# Altium schematic sheet MCU_B.SchDoc
size A3; SheetNumber: 2; SheetTotal: 5
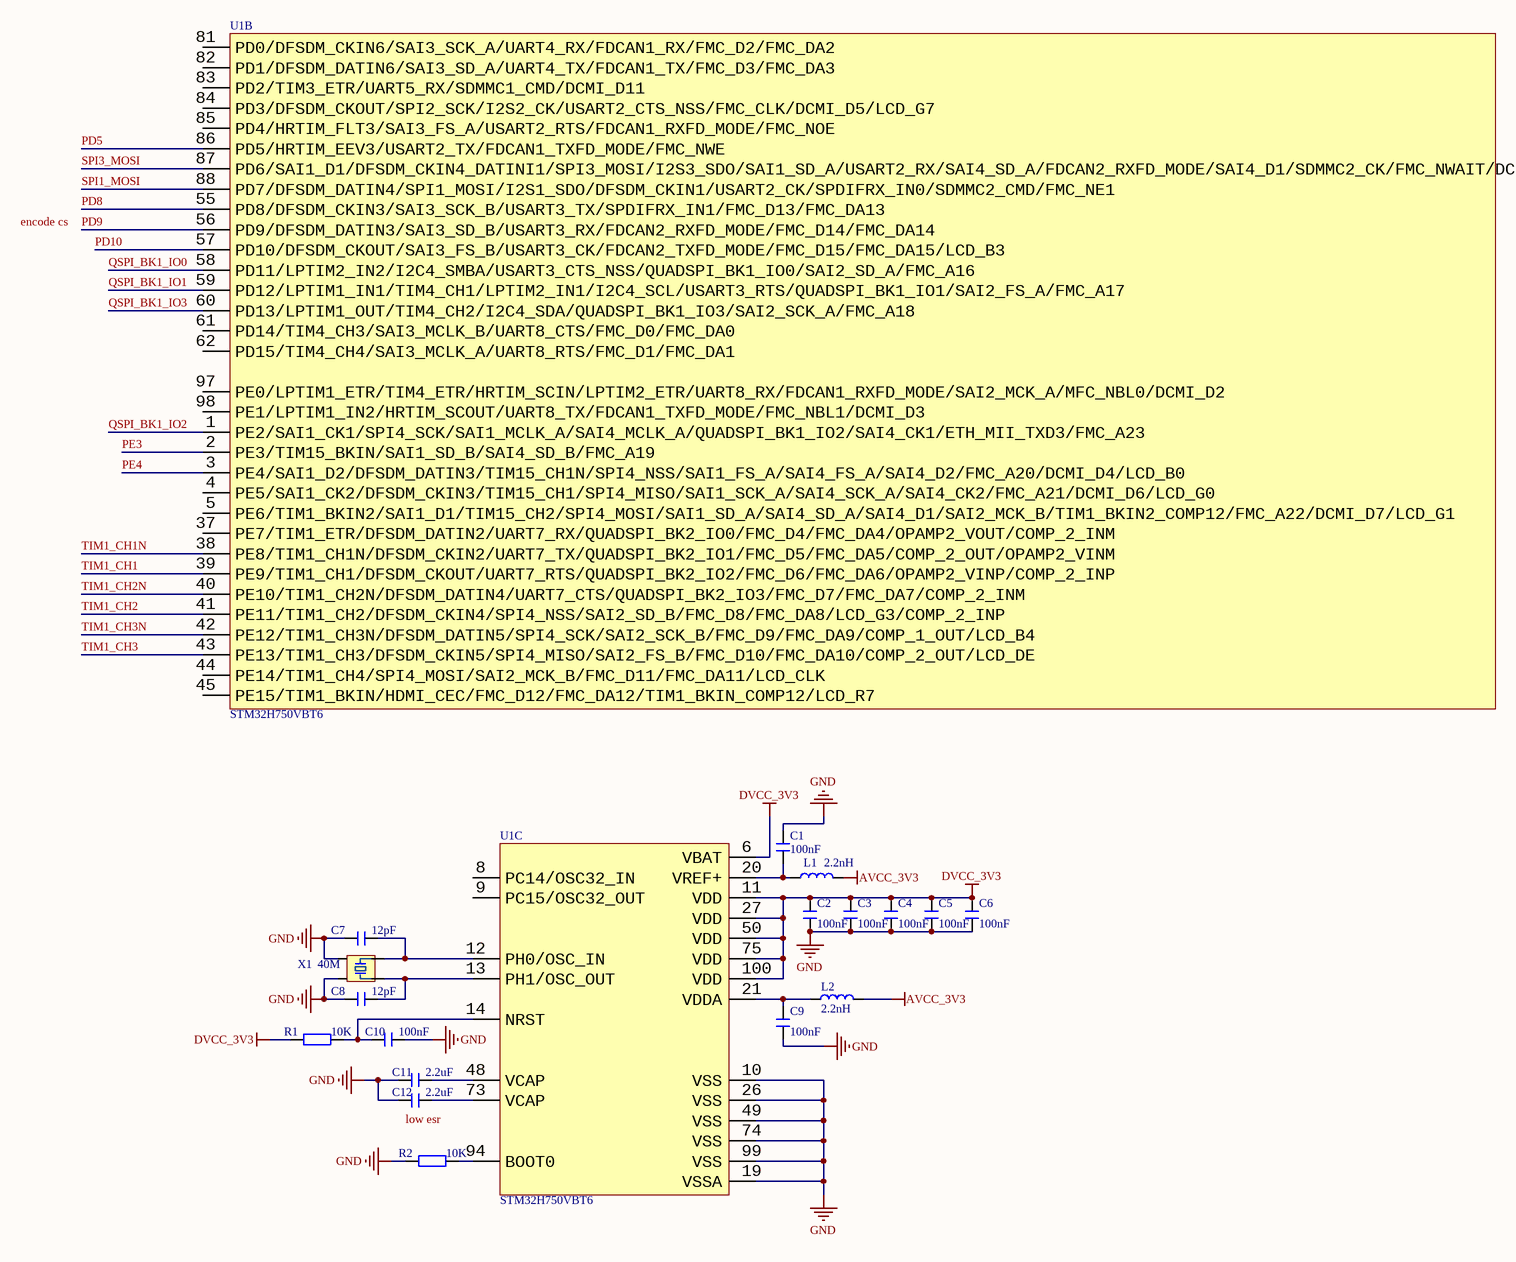
[diagram p0: MCU_B.SchDoc]

## Parts
C1  100nF  [C 0402_L]
C2  100nF  [C 0402_L]
C3  100nF  [C 0402_L]
C4  100nF  [C 0402_L]
C5  100nF  [C 0402_L]
C6  100nF  [C 0402_L]
C7  12pF  [C 0402_L]
C8  12pF  [C 0402_L]
C9  100nF  [C 0402_L]
C10  100nF  [C 0402_L]
C11  2.2uF  [C 0402_L]
C12  2.2uF  [C 0402_L]
L1  2.2nH  [L 0402]
L2  2.2nH  [L 0402]
R1  10K  [R 0402_L]
R2  10K  [R 0402_L]
U1  STM32H750VBT6  [LQFP100 14x14_L]  (parts B,C of 3)
X1  40M  [OSC 2016-4P]

## Nets
AVCC_3V3: L1.2 L2.2
DVCC_3V3: C2.2 C3.2 C4.2 C5.2 C6.2 R1.1 U1.6(VBAT) U1.11(VDD) U1.27(VDD) U1.50(VDD) U1.75(VDD) U1.100(VDD)
GND: C1.2 C2.1 C3.1 C4.1 C5.1 C6.1 C7.1 C8.1 C9.1 C10.2 C11.1 C12.1 R2.1 U1.10(VSS) U1.19(VSSA) U1.26(VSS) U1.49(VSS) U1.74(VSS) U1.99(VSS) X1.2 X1.4
PD5: U1.86(PD5/HRTIM_EEV3/USART2_TX/FDCAN1_TXFD_MODE/FMC_NWE)
PD8: U1.55(PD8/DFSDM_CKIN3/SAI3_SCK_B/USART3_TX/SPDIFRX_IN1/FMC_D13/FMC_DA13)
PD9: U1.56(PD9/DFSDM_DATIN3/SAI3_SD_B/USART3_RX/FDCAN2_RXFD_MODE/FMC_D14/FMC_DA14)
PD10: U1.57(PD10/DFSDM_CKOUT/SAI3_FS_B/USART3_CK/FDCAN2_TXFD_MODE/FMC_D15/FMC_DA15/LCD_B3)
PE3: U1.2(PE3/TIM15_BKIN/SAI1_SD_B/SAI4_SD_B/FMC_A19)
PE4: U1.3(PE4/SAI1_D2/DFSDM_DATIN3/TIM15_CH1N/SPI4_NSS/SAI1_FS_A/SAI4_FS_A/SAI4_D2/FMC_A20/DCMI_D4/LCD_B0)
QSPI_BK1_IO0: U1.58(PD11/LPTIM2_IN2/I2C4_SMBA/USART3_CTS_NSS/QUADSPI_BK1_IO0/SAI2_SD_A/FMC_A16)
QSPI_BK1_IO1: U1.59(PD12/LPTIM1_IN1/TIM4_CH1/LPTIM2_IN1/I2C4_SCL/USART3_RTS/QUADSPI_BK1_IO1/SAI2_FS_A/FMC_A17)
QSPI_BK1_IO2: U1.1(PE2/SAI1_CK1/SPI4_SCK/SAI1_MCLK_A/SAI4_MCLK_A/QUADSPI_BK1_IO2/SAI4_CK1/ETH_MII_TXD3/FMC_A23)
QSPI_BK1_IO3: U1.60(PD13/LPTIM1_OUT/TIM4_CH2/I2C4_SDA/QUADSPI_BK1_IO3/SAI2_SCK_A/FMC_A18)
SPI1_MOSI: U1.88(PD7/DFSDM_DATIN4/SPI1_MOSI/I2S1_SDO/DFSDM_CKIN1/USART2_CK/SPDIFRX_IN0/SDMMC2_CMD/FMC_NE1)
SPI3_MOSI: U1.87(PD6/SAI1_D1/DFSDM_CKIN4_DATINI1/SPI3_MOSI/I2S3_SDO/SAI1_SD_A/USART2_RX/SAI4_SD_A/FDCAN2_RXFD_MODE/SAI4_D1/SDMMC2_CK/FMC_NWAIT/DCMI_D10/LCD_B2)
TIM1_CH1: U1.39(PE9/TIM1_CH1/DFSDM_CKOUT/UART7_RTS/QUADSPI_BK2_IO2/FMC_D6/FMC_DA6/OPAMP2_VINP/COMP_2_INP)
TIM1_CH1N: U1.38(PE8/TIM1_CH1N/DFSDM_CKIN2/UART7_TX/QUADSPI_BK2_IO1/FMC_D5/FMC_DA5/COMP_2_OUT/OPAMP2_VINM)
TIM1_CH2: U1.41(PE11/TIM1_CH2/DFSDM_CKIN4/SPI4_NSS/SAI2_SD_B/FMC_D8/FMC_DA8/LCD_G3/COMP_2_INP)
TIM1_CH2N: U1.40(PE10/TIM1_CH2N/DFSDM_DATIN4/UART7_CTS/QUADSPI_BK2_IO3/FMC_D7/FMC_DA7/COMP_2_INM)
TIM1_CH3: U1.43(PE13/TIM1_CH3/DFSDM_CKIN5/SPI4_MISO/SAI2_FS_B/FMC_D10/FMC_DA10/COMP_2_OUT/LCD_DE)
TIM1_CH3N: U1.42(PE12/TIM1_CH3N/DFSDM_DATIN5/SPI4_SCK/SAI2_SCK_B/FMC_D9/FMC_DA9/COMP_1_OUT/LCD_B4)
NetC1_1: C1.1 L1.1 U1.20(VREF+)
NetC7_2: C7.2 U1.12(PH0/OSC_IN) X1.1
NetC8_2: C8.2 U1.13(PH1/OSC_OUT) X1.3
NetC9_2: C9.2 L2.1 U1.21(VDDA)
NetC10_1: C10.1 R1.2 U1.14(NRST)
NetC11_2: C11.2 U1.48(VCAP)
NetC12_2: C12.2 U1.73(VCAP)
NetR2_2: R2.2 U1.94(BOOT0)

Not connected (* = marked no-connect by the designer): U1 4(PE5/SAI1_CK2/DFSDM_CKIN3/TIM15_CH1/SPI4_MISO/SAI1_SCK_A/SAI4_SCK_A/SAI4_CK2/FMC_A21/DCMI_D6/LCD_G0) 5(PE6/TIM1_BKIN2/SAI1_D1/TIM15_CH2/SPI4_MOSI/SAI1_SD_A/SAI4_SD_A/SAI4_D1/SAI2_MCK_B/TIM1_BKIN2_COMP12/FMC_A22/DCMI_D7/LCD_G1) 8(PC14/OSC32_IN) 9(PC15/OSC32_OUT) 37(PE7/TIM1_ETR/DFSDM_DATIN2/UART7_RX/QUADSPI_BK2_IO0/FMC_D4/FMC_DA4/OPAMP2_VOUT/COMP_2_INM) 44(PE14/TIM1_CH4/SPI4_MOSI/SAI2_MCK_B/FMC_D11/FMC_DA11/LCD_CLK) 45(PE15/TIM1_BKIN/HDMI_CEC/FMC_D12/FMC_DA12/TIM1_BKIN_COMP12/LCD_R7) 61(PD14/TIM4_CH3/SAI3_MCLK_B/UART8_CTS/FMC_D0/FMC_DA0) 62(PD15/TIM4_CH4/SAI3_MCLK_A/UART8_RTS/FMC_D1/FMC_DA1) 81(PD0/DFSDM_CKIN6/SAI3_SCK_A/UART4_RX/FDCAN1_RX/FMC_D2/FMC_DA2) 82(PD1/DFSDM_DATIN6/SAI3_SD_A/UART4_TX/FDCAN1_TX/FMC_D3/FMC_DA3) 83(PD2/TIM3_ETR/UART5_RX/SDMMC1_CMD/DCMI_D11) 84(PD3/DFSDM_CKOUT/SPI2_SCK/I2S2_CK/USART2_CTS_NSS/FMC_CLK/DCMI_D5/LCD_G7) 85(PD4/HRTIM_FLT3/SAI3_FS_A/USART2_RTS/FDCAN1_RXFD_MODE/FMC_NOE) 97(PE0/LPTIM1_ETR/TIM4_ETR/HRTIM_SCIN/LPTIM2_ETR/UART8_RX/FDCAN1_RXFD_MODE/SAI2_MCK_A/MFC_NBL0/DCMI_D2) 98(PE1/LPTIM1_IN2/HRTIM_SCOUT/UART8_TX/FDCAN1_TXFD_MODE/FMC_NBL1/DCMI_D3)

## Notes on the sheet
- encode cs
- (near C12) low esr

## Library data of the parts
C1-C12 = C: 无极性贴片电容; 版权归属: 源创客; BOM名称: 无极性贴片电容; 学习资源: www.ooocke.com
L1 L2 = L: 小功率贴片电感; 版权归属: 源创客; BOM名称: 小功率贴片电感; 学习资源: www.ooocke.com
R1 R2 = R: 贴片电阻; 版权归属: 源创客; BOM名称: 贴片电阻; 学习资源: www.ooocke.com
X1 = XTAL-4P: 4脚无源晶振; 版权归属: 源创客; BOM名称: 4脚无源晶振; 学习资源: www.ooocke.com